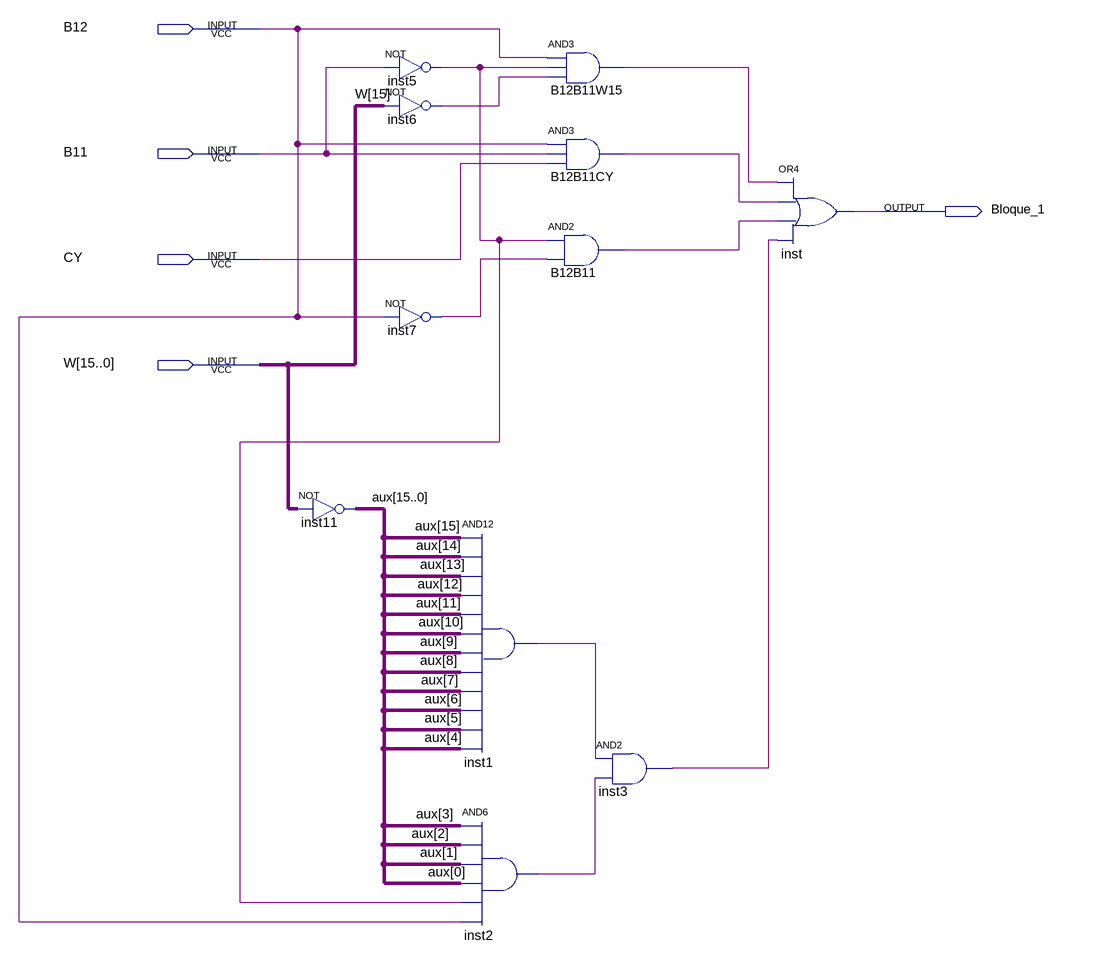
[diagram p0: schematic sheet]
// Quartus schematic BLOQUE_1.bdf as structural Verilog: 11 symbols, 5 pins
module BLOQUE_1 (
  input  B12,
  input  B11,
  input  CY,
  input  [15:0] W,
  output Bloque_1
);

  wire B12B11_out, B12B11CY_out, B12B11W15_out, inst1_out, inst2_out, inst3_out, inst5_out, inst6_out,
       inst7_out;
  wire [15:0] aux;

  assign aux = ~W;  // NOT inst11, 16 bits wide
  not inst5 (inst5_out, B11);
  not inst6 (inst6_out, W[15]);
  not inst7 (inst7_out, B12);
  and inst1 (inst1_out, aux[15], aux[14], aux[13], aux[12], aux[11], aux[10], aux[9], aux[8], aux[7], aux[6], aux[5], aux[4]);
  and inst2 (inst2_out, aux[3], aux[2], aux[1], aux[0], inst5_out, B12);
  and B12B11W15 (B12B11W15_out, B12, inst5_out, inst6_out);
  and B12B11CY (B12B11CY_out, B12, B11, CY);
  and B12B11 (B12B11_out, inst5_out, inst7_out);
  and inst3 (inst3_out, inst1_out, inst2_out);
  or inst (Bloque_1, B12B11W15_out, B12B11CY_out, B12B11_out, inst3_out);
endmodule
